# EAGLE design CPU_V1.1 (EAGLE 9.6.2)
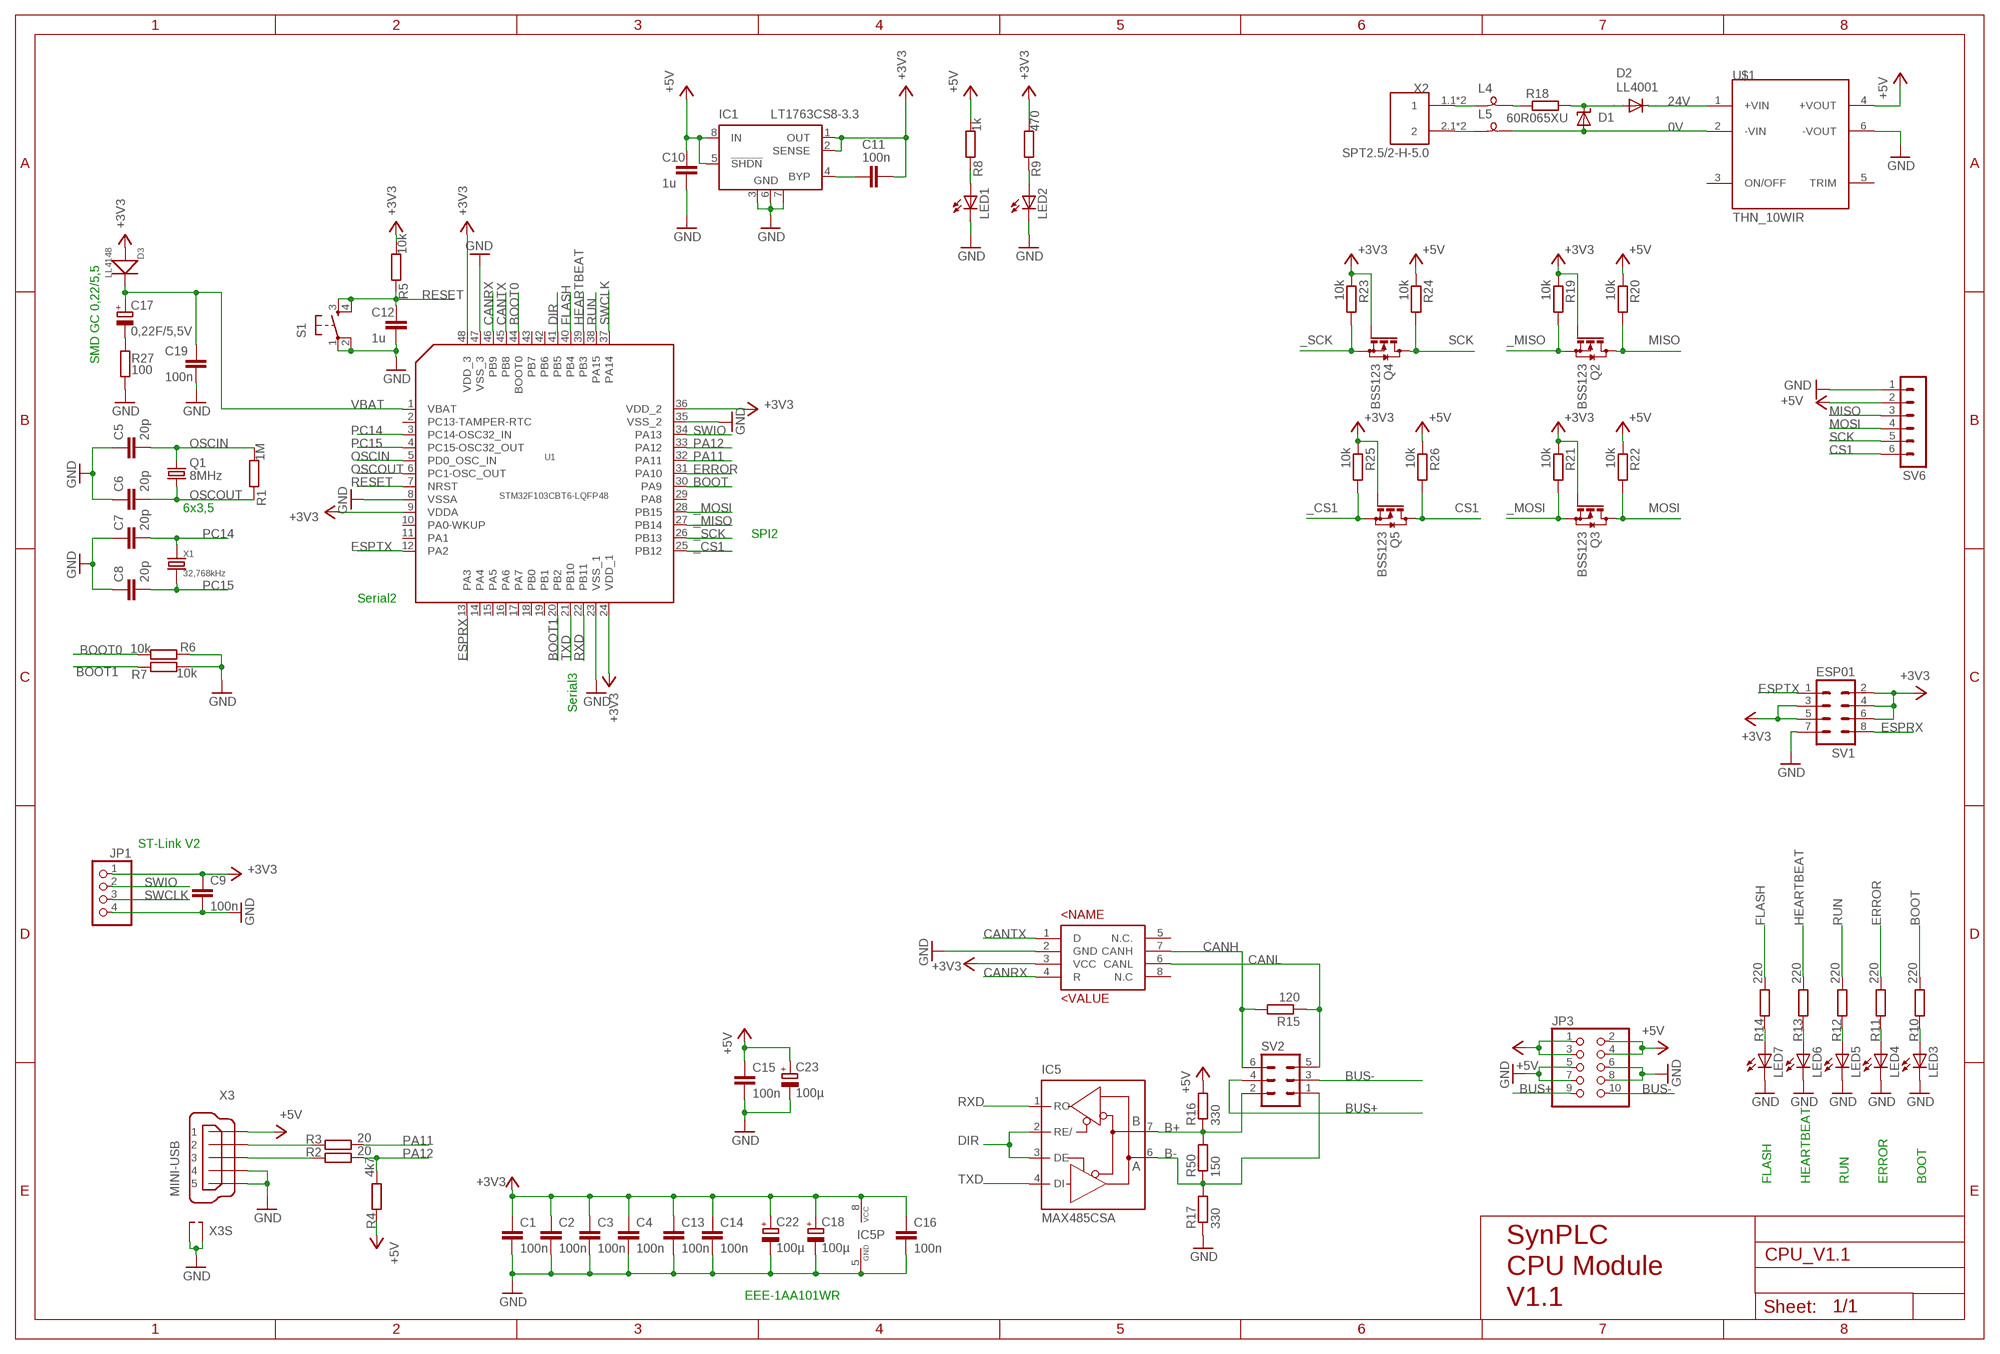
[diagram p0: schematic, sheet 1]

## Parts
C1  100n  C-EUC0805K  [C0805K]
C2  100n  C-EUC0805K  [C0805K]
C3  100n  C-EUC0805K  [C0805K]
C4  100n  C-EUC0805K  [C0805K]
C5  20p  C-EUC0805K  [C0805K]
C6  20p  C-EUC0805K  [C0805K]
C7  20p  C-EUC0805K  [C0805K]
C8  20p  C-EUC0805K  [C0805K]
C9  100n  C-EUC0805K  [C0805K]
C10  1u  C-EUC0805K  [C0805K]
C11  100n  C-EUC0805K  [C0805K]
C12  1u  C-EUC0805K  [C0805K]
C13  100n  C-EUC0805K  [C0805K]
C14  100n  C-EUC0805K  [C0805K]
C15  100n  C-EUC0805  [C0805]
C16  100n  C-EUC0805  [C0805]
C17  0,22F/5,5V  CPOL-EUG  [PANASONIC_G]
C18  100µ  CPOL-EU153CLV-0505  [153CLV-0505]
C19  100n  C-EUC0805K  [C0805K]
C22  100µ  CPOL-EU153CLV-0505  [153CLV-0505]
C23  100µ  CPOL-EU153CLV-0505  [153CLV-0505]
D1  SUPPRESSOR-SMBJ  [SMBJ]
D2  LL4001  CGRM4001-G  [SOD-123_MINI-SMA]
D3  LL4148  DIODE'1N4148-SMD'  [LL-34]
IC1  LT1763CS8-3.3  [SOIC8]
IC5  MAX485CSA  MAX481CSA  [SO08]
JP1  PINHD-1X4/90  [1X04/90]
JP3  PINHD-2X5/90  [2X05/90]
L4  SM-B5  [SM-B5]
L5  SM-B5  [SM-B5]
LED1  LEDSML0805  [SML0805]
LED2  LEDSML0805  [SML0805]
LED3  LED3MM  [LED3MM]
LED4  LED3MM  [LED3MM]
LED5  LED3MM  [LED3MM]
LED6  LED3MM  [LED3MM]
LED7  LED3MM  [LED3MM]
Q1  8MHz  KX-K  [11.4X4.5]
Q2  BSS123  [SOT23]
Q3  BSS123  [SOT23]
Q4  BSS123  [SOT23]
Q5  BSS123  [SOT23]
R1  1M  R-EU_R0805  [R0805]
R2  20  R-EU_R0805  [R0805]
R3  20  R-EU_R0805  [R0805]
R4  4k7  R-EU_R0805  [R0805]
R5  10k  R-EU_R0805  [R0805]
R6  10k  R-EU_R0805  [R0805]
R7  10k  R-EU_R0805  [R0805]
R8  1k  R-EU_R0805  [R0805]
R9  470  R-EU_R0805  [R0805]
R10  220  R-EU_R0805  [R0805]
R11  220  R-EU_R0805  [R0805]
R12  220  R-EU_R0805  [R0805]
R13  220  R-EU_R0805  [R0805]
R14  220  R-EU_R0805  [R0805]
R15  120  R-EU_R0805  [R0805]
R16  330  R-EU_R0805  [R0805]
R17  330  R-EU_R0805  [R0805]
R18  60R065XU  R-EU_0204/5  [0204/5]
R19  10k  R-EU_R0805  [R0805]
R20  10k  R-EU_R0805  [R0805]
R21  10k  R-EU_R0805  [R0805]
R22  10k  R-EU_R0805  [R0805]
R23  10k  R-EU_R0805  [R0805]
R24  10k  R-EU_R0805  [R0805]
R25  10k  R-EU_R0805  [R0805]
R26  10k  R-EU_R0805  [R0805]
R27  100  R-EU_R0805  [R0805]
R50  150  R-EU_R0805  [R0805]
S1  TAC_SWITCHPTH  [TACTILE-PTH]
SV1  ESP01  MA04-2  [MA04-2]
SV2  MA03-2  [MA03-2]
SV6  MA06-1  [MA06-1]
U1  STM32F103CBT6-LQFP48  MCU-STM32F103CBT6(LQFP48)  [LQFP48-0.5-7X7MM]
U$1  THN_10WIR  [THN10WIR]
U$3  SN65HVD232  [SO-08]
X1  32,768kHz  CRYSTAL'9133'  [X2-2.0-D9.1XL3.3MM]
X2  SPT2.5/2-H-5.0  [SPT2]
X3  MINI-USB  MINI-USB_SHIELD5P2-32005-601  [32005-601]

## Nets
0V: D1.A L5.1 U$1.2(-VIN)
24V: D2.C U$1.1(+VIN)
+3V3: C1.1 C2.1 C3.1 C4.1 C9.1 C11.1 C13.1 C14.1 C16.1 C18.+ C22.+ D3.A(+) IC1.1(OUT) IC1.2(SENSE) IC5.8(VCC) JP1.1 Q2.1(G) Q3.1(G) Q4.1(G) Q5.1(G) R5.2 R9.2 R19.1 R21.1 R23.1 R25.1 SV1.2 SV1.3 SV1.4 SV1.5 SV1.6 U1.9(VDDA) U1.24(VDD_1) U1.36(VDD_2) U1.48(VDD_3) U$3.3(VCC)
+5V: C10.1 C15.1 C23.+ IC1.5(!SHDN) IC1.8(IN) JP3.1 JP3.2 JP3.3 JP3.4 R4.1 R8.2 R16.2 R20.1 R22.1 R24.1 R26.1 SV6.2 U$1.4(+VOUT) X3.1
_CS1: Q5.2(S) R25.2 U1.25(PB12)
_MISO: Q2.2(S) R19.2 U1.27(PB14)
_MOSI: Q3.2(S) R21.2 U1.28(PB15)
_SCK: Q4.2(S) R23.2 U1.26(PB13)
B+: IC5.7(B) R16.1 R50.2 SV2.2
B-: IC5.6(A) R17.2 R50.1 SV2.1
BOOT: R10.2 U1.30(PA9)
BOOT0: R6.2 U1.44(BOOT0)
BOOT1: R7.1 U1.20(PB2)
BUS+: JP3.9 SV2.4
BUS-: JP3.10 SV2.3
CANH: R15.2 SV2.6 U$3.7(CANH)
CANL: R15.1 SV2.5 U$3.6(CANL)
CANRX: U1.46(PB9) U$3.4(R)
CANTX: U1.45(PB8) U$3.1(D)
CS1: Q5.3(D) R26.2 SV6.6
DIR: IC5.2(RE/) IC5.3(DE) U1.41(PB5)
ERROR: R11.2 U1.31(PA10)
ESPRX: SV1.8 U1.13(PA3)
ESPTX: SV1.1 U1.12(PA2)
FLASH: R14.2 U1.40(PB4)
GND: C1.2 C2.2 C3.2 C4.2 C5.1 C6.1 C7.1 C8.1 C9.2 C10.2 C12.2 C13.2 C14.2 C15.2 C16.2 C18.- C19.2 C22.- C23.- IC1.3(GND) IC1.6(GND) IC1.7(GND) IC5.5(GND) JP1.4 JP3.5 JP3.6 JP3.7 JP3.8 LED1.C LED2.C LED3.K(C) LED4.K(C) LED5.K(C) LED6.K(C) LED7.K(C) R6.1 R7.2 R17.1 R27.1 S1.1 S1.2 SV1.7 SV6.1 U1.8(VSSA) U1.23(VSS_1) U1.35(VSS_2) U1.47(VSS_3) U$1.6(-VOUT) U$3.2(GND) X3.4 X3.5 X3.M1(S1) X3.M2(S2)
HEARTBEAT: R13.2 U1.39(PB3)
MISO: Q2.3(D) R20.2 SV6.3
MOSI: Q3.3(D) R22.2 SV6.4
N$1: R3.1 X3.2
N$2: R2.1 X3.3
N$3: C11.2 IC1.4(BYP)
N$6: LED2.A R9.1
N$7: LED1.A R8.1
N$8: C17.- R27.2
N$11: LED3.A R10.1
N$12: LED4.A R11.1
N$15: LED5.A R12.1
N$16: LED6.A R13.1
N$17: LED7.A R14.1
N$19: L4.2 X2.1.1 X2.1.2
N$20: L5.2 X2.2.1 X2.2.2
N$21: L4.1 R18.1
N$22: D1.C D2.A R18.2
OSCIN: C5.2 Q1.2 R1.2 U1.5(PD0_OSC_IN)
OSCOUT: C6.2 Q1.1 R1.1 U1.6(PC1-OSC_OUT)
PA11: R3.2 U1.32(PA11)
PA12: R2.2 R4.2 U1.33(PA12)
PC14: C7.2 U1.3(PC14-OSC32_IN) X1.2
PC15: C8.2 U1.4(PC15-OSC32_OUT) X1.1
RESET: C12.1 R5.1 S1.3 S1.4 U1.7(NRST)
RUN: R12.2 U1.38(PA15)
RXD: IC5.1(RO) U1.22(PB11)
SCK: Q4.3(D) R24.2 SV6.5
SWCLK: JP1.3 U1.37(PA14)
SWIO: JP1.2 U1.34(PA13)
TXD: IC5.4(DI) U1.21(PB10)
VBAT: C17.+ C19.1 D3.C(-) U1.1(VBAT)
Unconnected: U1.2(PC13-TAMPER-RTC) U1.10(PA0-WKUP) U1.11(PA1) U1.14(PA4) U1.15(PA5) U1.16(PA6) U1.17(PA7) U1.18(PB0) U1.19(PB1) U1.29(PA8) U1.42(PB6) U1.43(PB7) U$1.3(ON/OFF) U$1.5(TRIM) U$3.5(N.C.) U$3.8(N.C)

## Notes on the sheet
- SMD GC 0,22/5,5
- 6x3,5
- SPI2
- Serial2
- Serial3
- ST-Link V2
- FLASH | HEARTBEAT | RUN | ERROR | BOOT
- EEE-1AA101WR
- SynPLC
  CPU Module
  V1.1

## Library data of the parts
C1-C16 C19 = rcl:C-EU: CAPACITOR, European symbol; SPICEPREFIX: C
C17 C18 C22 C23 = rcl:CPOL-EU: POLARIZED CAPACITOR, European symbol; SPICEPREFIX: C
D1 = diode:SUPPRESSOR-: Suppressor diode
D2 = diode:CGRM400*-G: Molded plasitc,JEDEC SOD-123/Mini SMA Source: Comchip CGRM4001-G.pdf
D3 = Seeed-OPL-Diode:DIODE*
IC1 = linear-technology:LT1763CS8: 500mA, Low Noise, LDO Micropower Regulators Source: http://cds.linear.com/docs/Datasheet/1763ff.pdf; MPN: LT1763CS8-3.3; OC_FARNELL: 1273617; OC_NEWARK: 57M6055
IC5 = maxim:MAX481CSA: RS485 TRANSEIVER; MF: MAXIM; MPN: MAX481CSA; OC_FARNELL: unknown; OC_NEWARK: 90C3817
JP1 = pinhead:PINHD-1X4: PIN HEADER
JP3 = pinhead:PINHD-2X5: PIN HEADER
L4 L5 = inductor-neosid:SM-B: INDUCTOR SMD Bead inductor; OC_FARNELL: unknown; OC_NEWARK: unknown
LED1-LED7 = led:LED: LED OSRAM: - CHIPLED LG R971, LG N971, LY N971, LG Q971, LY Q971, LO R971, LY R971 LH N974, LH R974 LS Q976, LO Q976, LY Q976 LO Q996 - Hyper CHIPLED LW Q18S LB Q993, LB Q99A, LB R99A - SideLED LS A670, LO A670, LY A670, LG A670, LP A670 LB A673, LV A673, LT A673, LW A673 LH A674 LY A675 LS A676, LA A676, LO A676, LY A676, LW A676 LS A679, LY A679, LG A679 - Hyper Micro SIDELED® LS Y876, LA Y876, LO Y876, LY Y876 LT Y87S - SmartLED LW L88C, LW L88S LB L89C, LB L89S, LG L890 LS L89K, LO L89K, LY L89K LS L896, LA L896, LO L896, LY L896 - TOPLED LS T670, LO T670, LY T670, LG T670, LP T670 LSG T670, LSP T670, LSY T670, LOP T670, LYG T670 LG T671, LOG T671, LSG T671 LB T673, LV T673, LT T673, LW T673 LH T674 LS T676, LA T676, LO T676, LY T676, LB T676, LH T676, LSB T676, LW T676 LB T67C, LV T67C, LT T67C, LS T67K, LO T67K, LY T67K, LW E67C LS E67B, LA E67B, LO E67B, LY E67B, LB E67C, LV E67C, LT E67C LW T67C LS T679, LY T679, LG T679 LS T770, LO T770, LY T770, LG T770, LP T770 LB T773, LV T773, LT T773, LW T773 LH T774 LS E675, LA E675, LY E675, LS T675 LS T776, LA T776, LO T776, LY T776, LB T776 LHGB T686 LT T68C, LB T68C - Hyper Mini TOPLED® LB M676 - Mini TOPLED Santana® LG M470 LS M47K, LO M47K, LY M47K Source: http://www.osram.convergy.de LUXEON: - LUMILED® LXK2-PW12-R00, LXK2-PW12-S00, LXK2-PW14-U00, LXK2-PW14-V00 LXK2-PM12-R00, LXK2-PM12-S00, LXK2-PM14-U00 LXK2-PE12-Q00, LXK2-PE12-R00, LXK2-PE12-S00, LXK2-PE14-T00, LXK2-PE14-U00 LXK2-PB12-K00, LXK2-PB12-L00, LXK2-PB12-M00, LXK2-PB14-N00, LXK2-PB14-P00, LXK2-PB14-Q00 LXK2-PR12-L00, LXK2-PR12-M00, LXK2-PR14-Q00, LXK2-PR14-R00 LXK2-PD12-Q00, LXK2-PD12-R00, LXK2-PD12-S00 LXK2-PH12-R00, LXK2-PH12-S00 LXK2-PL12-P00, LXK2-PL12-Q00, LXK2-PL12-R00 Source: www.luxeon.com KINGBRIGHT: KA-3528ASYC Source: www.kingbright.com
Q1 = crystal-geyer_V1_0:KX: Quartz Crystals (MHz) SMD: KX - Serie Model Size l/w/h [mm] Frequency Range Frequency Stability Temp. Range [°C] Load Capacitance AECQ 200 availabel Datasheet KX-4 KX-5 KX-6 KX-7 KX-9A KX-9B KX-12A KX-12B KX-13 KX-20 KX-K KX-KS 1.6/1.2/0.3 2.0/1.6/0.45 2.5/2.0/0.55 3.2/2.5/0.8 5.0/3.2/1.0 5.0/3.2/1.1 6.0/3.5/1.1 6.0/3.5/1.0 7.0/5.0 /1.3 11.6/5.5/1.6 12.3/4.5/4.2 12.3/4.5/3.2 24.0 ~ 80.0 MHz 16.0 ~ 80.0 MHz 12.0 ~ 80.0 MHz 8.0 ~ 60.0 MHz 7,68 ~ 300,0 MHz 8,0 ~ 50,0 MHz 8,0 ~ 150,0 MHz 8,0 ~ 50,0 MHz 6,0 ~ 160,0 MHz 3,579 ~ 25,0 MHz 3,579 ~ 70,0 MHz 3,579 ~ 70,0 MHz ±10 … ±50ppm ±10 … ±50ppm ±10 … ±50ppm ±10 … ±50ppm ±10 … ±50ppm ±10 … ±50ppm ±10 … ±50ppm ±10 … ±50ppm ±10 … ±50ppm ±50ppm ±10 … ±50ppm ±10 … ±50ppm (*) -40°C …+85°C (*) -40°C …+125°C (*) -40°C …+125°C (*) -40°C …+125°C (*) -40°C …+105°C (*) -40°C …+105°C (*) -40°C …+125°C (*) -40°C …+105°C (*) -40°C …+105°C (*) -40°C …+105°C (*) -40°C …+85°C (*) -40°C …+85°C 8, 8…16 8, 8…16 10, 8…16 12, 7…20 16, 10…20 16, 10…20 16, 10…20 16, 12…20 16, 12…20 16, 12…20 16, 12…30 16, 12…30 - yes yes yes - - - - - - - - KX-4.pdf <http://www.geyer-electronic.de/uploads/tx_userartikelfrequenz/GEYER-KX-4.pdf> KX-5.pdf <http://www.geyer-electronic.de/uploads/tx_userartikelfrequenz/GEYER-KX-5.pdf> KX-6.pdf <http://www.geyer-electronic.de/uploads/tx_userartikelfrequenz/GEYER-KX-6.pdf> KX-7.pdf <http://www.geyer-electronic.de/uploads/tx_userartikelfrequenz/GEYER-KX-7.pdf> KX-9A.pdf <http://www.geyer-electronic.de/uploads/tx_userartikelfrequenz/GEYER-KX-9A.pdf> KX-9B.pdf <http://www.geyer-electronic.de/uploads/tx_userartikelfrequenz/GEYER-KX-9B.pdf> KX-12A.pdf <http://www.geyer-electronic.de/uploads/tx_userartikelfrequenz/GEYER-KX-12A.pdf> KX-12B.pdf <http://www.geyer-electronic.de/uploads/tx_userartikelfrequenz/GEYER-KX-12B.pdf> KX-13.pdf <http://www.geyer-electronic.de/uploads/tx_userartikelfrequenz/GEYER-KX-13.pdf> KX-20.pdf <http://www.geyer-electronic.de/uploads/tx_userartikelfrequenz/GEYER-KX-20.pdf> KX-K.pdf <http://www.geyer-electronic.de/uploads/tx_userartikelfrequenz/GEYER-KX-K.pdf> KX-KS.pdf <http://www.geyer-electronic.de/uploads/tx_userartikelfrequenz/GEYER-KX-KS.pdf> <http://www.geyer-electronic.de/fileadmin/template/img/logo-geyer-electronic.png> Details see: http://www.geyer-electronic.de/Frequenz-Produkte.9.0.html Created 2016-06-07, Hans Locher 2016 (C) Geyer Quartz Technology KX4,KX5,KX6,KX7,KX9A,KX9B,KX12A,KX12B,KX13,KX20,KXK,KXKS;1612;2016;2520;3225;5032;6035;7050;11655;12345;1,6x1,2;2,0x1,6;2,5x2,0;3,2x2,5;5,0x3,2;6,0x3,5;7,0x5,0;11,6x5,5;12,3x4,5;12,3x4,5;1.6x1.2;2.0x1.6;2.5x2.0;3.2x2.5;5.0x3.2;6.0x3.5;7.0x5.0;11.6x5.5;12.3x4.5;12.3x4.5;
Q2-Q5 = transistor-small-signal:BSS123: N-CHANNEL MOS FET
R1-R27 R50 = rcl:R-EU_: RESISTOR, European symbol; SPICEPREFIX: R
S1 = SparkFun-Retired:TAC_SWITCH: Momentary Switch Button commonly used for reset or general input. Spark Fun Electronics SKU : COM-00097 SMT- SWCH-08247
SV1 = con-lstb:MA04-2: PIN HEADER; OC_FARNELL: unknown; OC_NEWARK: unknown
SV2 = con-lstb:MA03-2: PIN HEADER; OC_FARNELL: unknown; OC_NEWARK: unknown
SV6 = con-lstb:MA06-1: PIN HEADER; OC_FARNELL: unknown; OC_NEWARK: unknown
U1 = Seeed-OPL-ic:MCU-STM32F103CBT6(LQFP48): 310010004; MPN: STM32F103CBT6
U$1 = traco-electronic:THN_10WIR
U$3 = texas:SN65HVD232
X1 = Seeed-OPL-Crystal-Oscillator:CRYSTAL
X2 = con-phoenix-500:SPT2.5/2-H-5.0: Phönix Contact SPT 2.5/ 2-H-5.0 Federzugklemme 2polig 5mm liegend 1990973
X3 = con-cypressindustries:MINI-USB_SHIELD5P2-: MINI USB-B R/A DIP 5pol. Source: www.cypressindustries.com; OC_FARNELL: unknown; OC_NEWARK: unknown

## Board
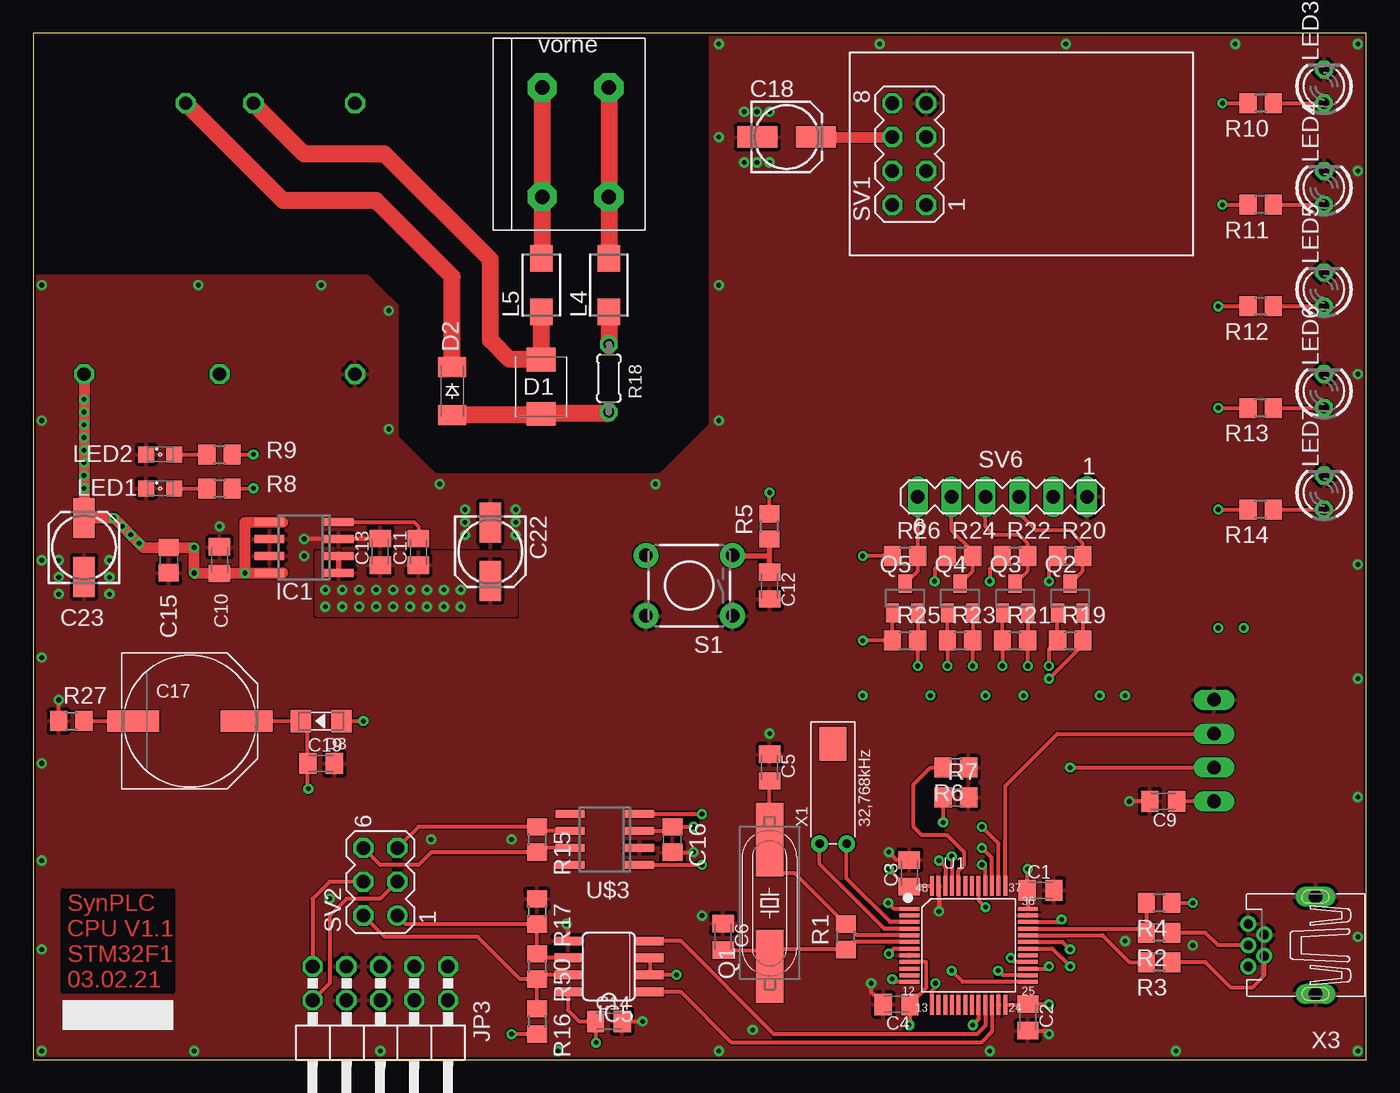
[diagram p1: board, top side]
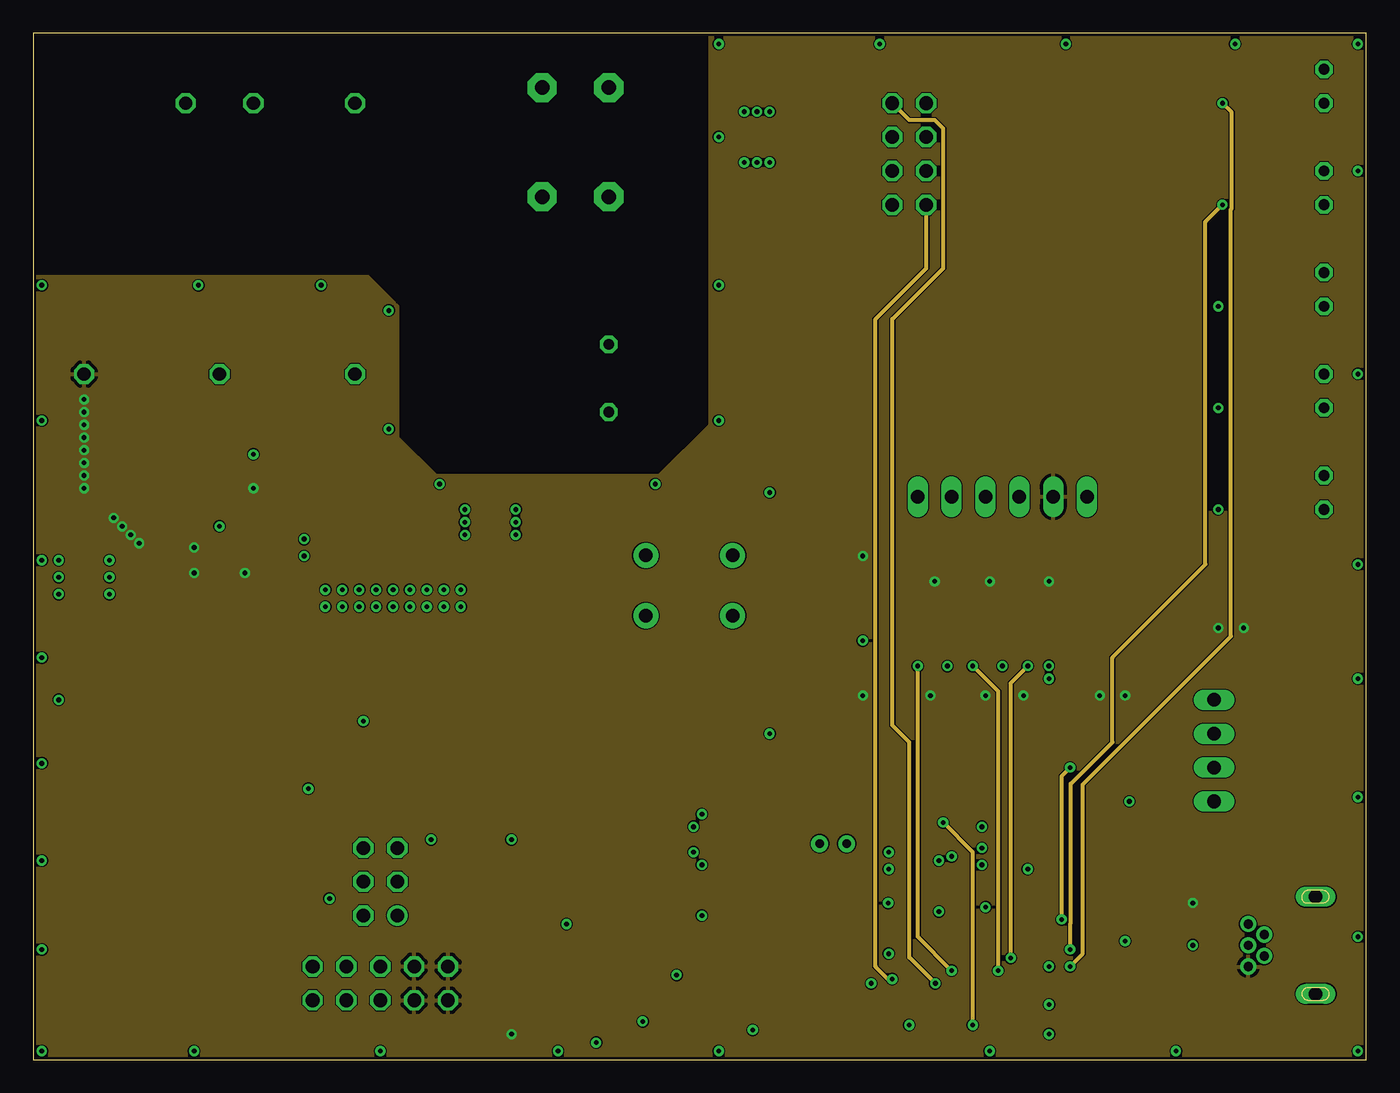
[diagram p2: board, inner layer Route2]
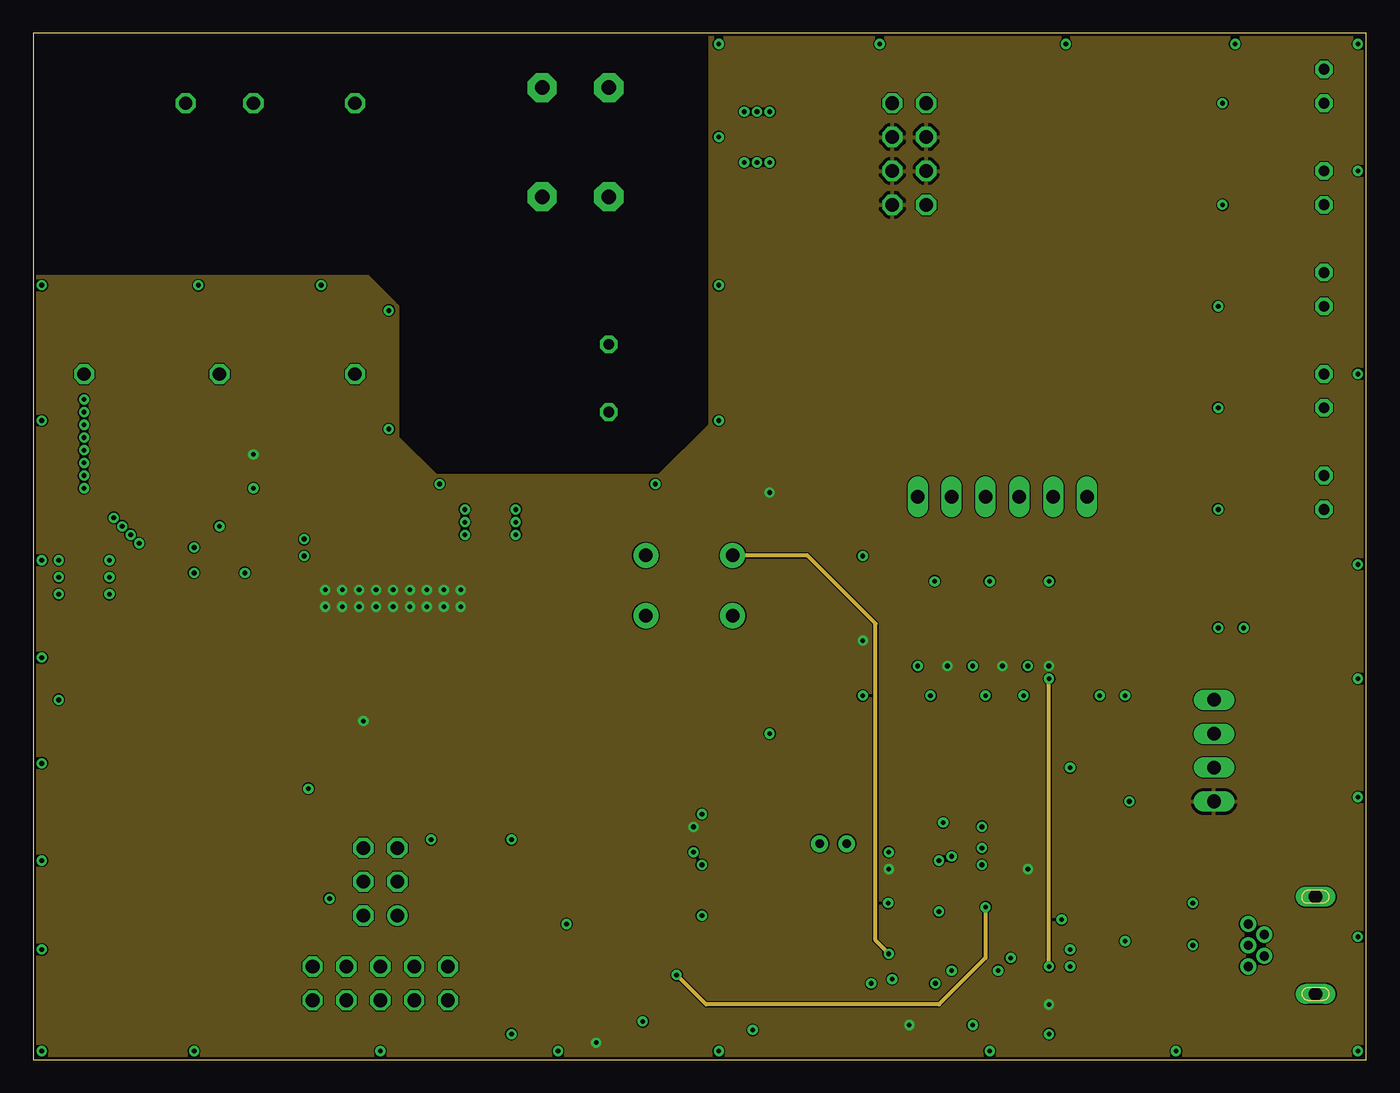
[diagram p3: board, inner layer Route15]
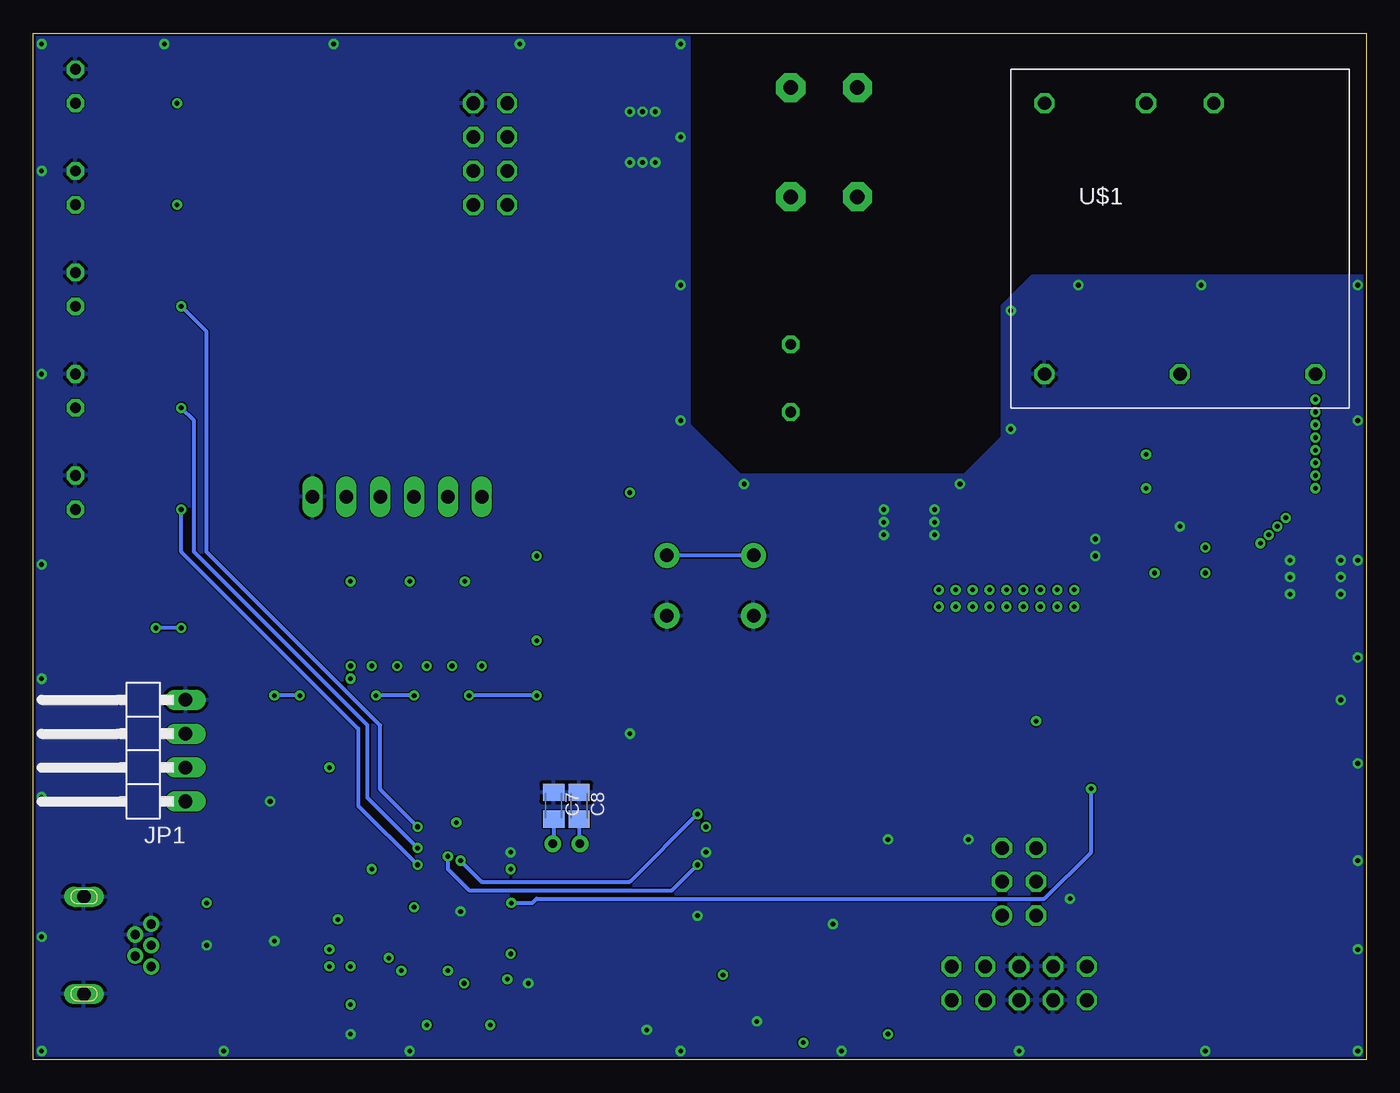
[diagram p4: board, bottom side, seen from below]

Size 100 x 77 mm. Coordinates in mm from the lower left corner, seen from the top.
Outline: 0,0 100,0 100,77 0,77 0,0
Copper layers (1+2*15+16): Top 0.035mm / dielectric 0.2mm / Route2 0.017mm / dielectric 1.065mm / Route15 0.017mm / dielectric 0.2mm / Bottom 0.035mm
Design rules "jlc *": minimum track width 3.5mil, minimum drill 0.2mm, track to track 3.5mil, track to pad 6mil, pad to pad 6mil, via to via 6mil, smd to smd 6mil, copper to edge 0.2mm, drill to drill 6mil, minimum pad ring 10mil, minimum via ring 8mil, stop-mask expansion 4mil, vias tented up to drill 0mil, thermal gap 10mil
tRestrict: 11 lines

### Footprints (pad centres in the part's own frame; a part is rotated, then mirrored left to right if it is on the bottom)
C0805K = smd 1.3 x 1.6: 1 -1,0; 2 1,0
C0805 = smd 1.3 x 1.5: 1 -0.95,0; 2 0.95,0
PANASONIC_G = smd 3.9 x 1.6: + 4.25,0; - -4.25,0
153CLV-0505 = smd 3 x 1.6: + 2.2,0; - -2.2,0
SMBJ = smd 1.78 x 2.16: A 2.04,0; C -2.03,0
SOD-123_MINI-SMA = smd 1.5 x 2.1: A 1.8,0; C -1.8,0
LL-34 = smd 1.524 x 1.676: A -1.524,0; C 1.524,0
SOIC8 = smd 0.6 x 2.2: 1 -1.905,-2.6; 2 -0.635,-2.6; 3 0.635,-2.6; 4 1.905,-2.6; 5 1.905,2.6; 6 0.635,2.6; 7 -0.635,2.6; 8 -1.905,2.6
SO08 = smd 0.66 x 2.032: 1 -1.905,-3.073; 2 -0.635,-3.073; 3 0.635,-3.073; 4 1.905,-3.073; 5 1.905,3.073; 6 0.635,3.073; 7 -0.635,3.073; 8 -1.905,3.073
1X04/90 = drill 1.016 long: 1 -3.81,-3.81; 2 -1.27,-3.81; 3 1.27,-3.81; 4 3.81,-3.81
2X05/90 = drill 1.016 octagon: 1 -5.08,-6.35; 2 -5.08,-3.81; 3 -2.54,-6.35; 4 -2.54,-3.81; 5 0,-6.35; 6 0,-3.81; 7 2.54,-6.35; 8 2.54,-3.81; 9 5.08,-6.35; 10 5.08,-3.81
SM-B5 = smd 2 x 1.7: 1 -2,0; 2 2,0
SML0805 = smd 1.2 x 1.2: A 1.05,0; C -1.05,0
LED3MM = drill 0.813 octagon: A -1.27,0; K 1.27,0
11.4X4.5 = smd 5.5 x 2.08: 1 -4.75,0; 2 4.75,0
SOT23 = smd 1 x 1.4: 1 -0.95,-1.1; 2 0.95,-1.1; 3 0,1.1
R0805 = smd 1.3 x 1.5: 1 -0.95,0; 2 0.95,0
0204/5 = drill 0.813 octagon: 1 -2.54,0; 2 2.54,0
TACTILE-PTH = drill 1.016 pad 1.88: 1 -3.251,2.261; 2 3.251,2.261; 3 -3.251,-2.261; 4 3.251,-2.261
MA04-2 = drill 1.016 octagon: 1 -3.81,-1.27; 2 -3.81,1.27; 3 -1.27,-1.27; 4 -1.27,1.27; 5 1.27,-1.27; 6 1.27,1.27; 7 3.81,-1.27; 8 3.81,1.27
MA03-2 = drill 1.016: 1 -2.54,-1.27 | drill 1.016 octagon: 2 -2.54,1.27; 3 0,-1.27; 4 0,1.27; 5 2.54,-1.27; 6 2.54,1.27
MA06-1 = drill 1.016 long: 1 -6.35,0; 2 -3.81,0; 3 -1.27,0; 4 1.27,0; 5 3.81,0; 6 6.35,0
LQFP48-0.5-7X7MM = smd 1.5 x 0.3: 1 -4.45,2.75; 2 -4.45,2.25; 3 -4.45,1.75; 4 -4.45,1.25; 5 -4.45,0.75; 6 -4.45,0.25; 7 -4.45,-0.25; 8 -4.45,-0.75; 9 -4.45,-1.25; 10 -4.45,-1.75; 11 -4.45,-2.25; 12 -4.45,-2.75; 25 4.45,-2.75; 26 4.45,-2.25; 27 4.45,-1.75; 28 4.45,-1.25; 29 4.45,-0.75; 30 4.45,-0.25; 31 4.45,0.25; 32 4.45,0.75; 33 4.45,1.25; 34 4.45,1.75; 35 4.45,2.25; 36 4.45,2.75 | smd 0.3 x 1.5: 13 -2.75,-4.45; 14 -2.25,-4.45; 15 -1.75,-4.45; 16 -1.25,-4.45; 17 -0.75,-4.45; 18 -0.25,-4.45; 19 0.25,-4.45; 20 0.75,-4.45; 21 1.25,-4.45; 22 1.75,-4.45; 23 2.25,-4.45; 24 2.75,-4.45; 37 2.75,4.45; 38 2.25,4.45; 39 1.75,4.45; 40 1.25,4.45; 41 0.75,4.45; 42 0.25,4.45; 43 -0.25,4.45; 44 -0.75,4.45; 45 -1.25,4.45; 46 -1.75,4.45; 47 -2.25,4.45; 48 -2.75,4.45
THN10WIR = drill 1 octagon: 1 15.24,22.86; 2 10.16,22.86; 3 2.54,22.86; 4 22.86,2.54; 5 12.7,2.54; 6 2.54,2.54
SO-08 = smd 0.6 x 2.2: 1 -1.905,-2.6; 2 -0.635,-2.6; 3 0.635,-2.6; 4 1.905,-2.6; 5 1.905,2.6; 6 0.635,2.6; 7 -0.635,2.6; 8 -1.905,2.6
X2-2.0-D9.1XL3.3MM = drill 0.635 pad 1.27: 1 -1.016,0; 2 1.016,0 | smd 2.032 x 2.54: 3 0,7.493
SPT2 = drill 1.1 pad 2.184 octagon: 1.1 7.3,10.7; 1.2 7.3,2.5; 2.1 2.3,10.7; 2.2 2.3,2.5
32005-601 = drill 0.7 pad 1.016: 1 2.825,1.6; 2 1.625,0.8; 3 2.825,0; 4 1.625,-0.8; 5 2.825,-1.6 | drill 1 pad 1.422 long: M1 -2.225,3.65; M2 -2.225,-3.65

### Placement (x,y rotation side)
C1  75.56,12.7 0 top
C2  74.61,3.17 270 top
C3  65.72,13.97 90 top
C4  64.77,4.13 180 top
C5  55.24,21.91 270 top
C6  51.75,9.21 270 top
C7  60.96,19.05 270 bottom
C8  59.05,19.05 270 bottom
C9  84.77,19.37 180 top
C10  13.97,37.47 90 top
C11  28.89,38.1 90 top
C12  55.24,35.56 270 top
C13  26.04,38.1 90 top
C14  43.18,2.86 0 top
C15  10.16,37.47 270 top
C16  47.94,16.51 270 top
C17  11.75,25.4 0 top
C18  56.52,69.22 0 top
C19  21.59,22.23 0 top
C22  34.29,38.1 270 top
C23  3.81,38.42 90 top
D1  38.1,50.48 90 top
D2  31.43,50.16 270 top
D3  21.59,25.4 180 top
IC1  20.32,38.42 90 top
IC5  43.18,6.99 90 top
JP1  92.39,23.18 90 bottom
JP3  26.04,0.64 180 top
L4  43.18,58.1 90 top
L5  38.1,58.1 90 top
LED1  9.53,42.86 0 top
LED2  9.53,45.4 0 top
LED3  96.84,73.03 90 top
LED4  96.84,65.41 90 top
LED5  96.84,57.78 90 top
LED6  96.84,50.16 90 top
LED7  96.84,42.55 90 top
Q1  55.24,11.75 90 top
Q2  77.79,34.61 0 top
Q3  73.66,34.61 0 top
Q4  69.53,34.61 0 top
Q5  65.41,34.61 0 top
R1  60.96,9.21 90 top
R2  84.45,9.53 180 top
R3  84.45,7.3 180 top
R4  84.45,11.75 180 top
R5  55.24,40.01 90 top
R6  69.22,21.91 180 top
R7  69.22,19.68 0 top
R8  13.97,42.86 0 top
R9  13.97,45.4 0 top
R10  92.08,71.75 180 top
R11  92.08,64.14 180 top
R12  92.08,56.52 180 top
R13  92.08,48.9 180 top
R14  92.08,41.27 180 top
R15  37.78,16.51 270 top
R16  37.78,2.86 270 top
R17  37.78,11.11 270 top
R18  43.18,51.12 270 top
R19  77.79,31.43 0 top
R20  77.79,37.78 0 top
R21  73.66,31.43 0 top
R22  73.66,37.78 0 top
R23  69.53,31.43 0 top
R24  69.53,37.78 0 top
R25  65.41,31.43 0 top
R26  65.41,37.78 0 top
R27  2.86,25.4 0 top
R50  37.78,6.99 270 top
S1  49.21,35.56 180 top
SV1  65.72,67.94 90 top
SV2  26.04,13.34 90 top
SV6  72.71,42.23 180 top
U1  70.17,8.57 0 top
U$1  26.67,48.9 0 bottom
U$3  42.86,16.51 90 top
X1  60.01,16.19 0 top
X2  35.88,62.23 0 top
X3  93.98,8.57 180 top

### Tracks (layer width: path | path; a pad name or v marks a point on that pad's centre or on a via)
0V
  Top 1.27: L5.1 D1.A 35.74,52.52 34.29,53.98 34.29,60.01 26.35,67.94 20.32,67.94 U$1.2
24V
  Top 1.27: D2.C 31.43,58.74 25.72,64.45 18.73,64.45 U$1.1
+3V3  (via drill 0.35)
  Top 0.305: U$3.3 47.63,17.14 C16.1 v49.53,17.46 | U1.48 65.78,13.02 C3.1 65.5,12.97 v64.18,14.29 | JP1.1 C9.1 | U1.24 74.56,4.12 C2.1 76.15,4.17 v76.2,4.13 | U1.9 66.97,7.32 66.99,7.3 66.99,5.4 65.77,4.17 C4.1 65.77,2.63 v65.72,2.59 | U1.36 74.62,12.65 C1.1 74.56,14.24 v74.61,14.29 | R5.2 v55.24,42.55 | R9.2 v16.51,45.4 | D3.A v24.77,25.4 | IC5.8 40.11,3.71 40.96,2.86 C14.1 42.18,1.32 v42.23,1.27 | v62.23,31.43 R25.1 Q5.1 | v68.58,29.53 R23.1 Q4.1 | v72.71,29.53 R21.1 Q3.1 | v76.19,29.53 76.19,30.79 R19.1 Q2.1
  Top 0.406: IC1.1 22.92,37.15 IC1.2
  Top 0.813: C18.+ SV1.6
  other vias: 32.07,35.24 30.8,35.24 29.53,35.24 28.26,35.24 26.99,35.24 25.72,35.24 24.45,35.24 23.18,35.24 21.91,35.24 21.91,33.97 23.18,33.97 24.45,33.97 25.72,33.97 26.99,33.97 28.26,33.97 29.53,33.97 30.8,33.97 32.07,33.97
  pour Route15 (rank 6): 0,58.74 25.08,58.74 27.3,56.52 27.3,46.67 30.16,43.81 46.99,43.81 50.8,47.62 50.8,76.83 100.01,76.83 100.01,0 0,0
  pour Top: 21.59,38.1 36.2,38.1 36.2,33.34 21.27,33.34 21.27,38.1
+5V  (via drill 0.35)
  Top 0.305: R8.2 v16.51,42.86 | R20.1 76.2,37.15 v76.2,35.88 | R22.1 71.75,36.83 v71.75,35.88 | R24.1 67.63,36.83 v67.63,35.88 | R26.1 v62.23,37.78 | R4.1 v87,11.75 | R16.2 v35.88,1.91
  Top 0.813: U$1.4 v3.81,49.53 v3.81,48.58 v3.81,47.62 v3.81,46.67 v3.81,45.72 v3.81,44.77 v3.81,43.81 v3.81,42.86 C23.+ 6.05,40.62 v7.94,38.73 8.26,38.41 C15.1 v12.06,38.41 | v12.06,38.41 v12.06,38.42 | v12.06,38.41 v12.06,36.52 v12.06,36.51 12.11,36.47 C10.1 14.02,36.51 v15.88,36.51 | v15.88,36.51 IC1.8 18.73,36.51 | v15.88,36.51 15.88,40.32 IC1.5 18.73,40.32
  Bottom 0.305: v62.23,27.3 v67.31,27.3 | v71.44,27.3 v74.3,27.3 | v80.01,27.3 v81.92,27.3 | v88.9,32.38 v90.81,32.38
  other vias: 7.3,39.37 6.67,40.01 6.03,40.64
  pour Route2 (rank 6): 0,58.74 25.08,58.74 27.3,56.52 27.3,46.67 30.16,43.81 46.99,43.81 50.8,47.62 50.8,76.83 100.01,76.83 100.01,0 0,0
_CS1  (via drill 0.35)
  Top 0.305: U1.25 69.74,5.82 v68.9,6.67 | v66.36,29.53 R25.2 Q5.2
  Route2 0.305: v68.9,6.67 66.36,9.21 v66.36,29.53
_MISO  (via drill 0.35)
  Top 0.305: Q2.2 R19.2 78.74,31.11 v76.2,28.57 | U1.27 76.04,6.82 v76.2,6.99
  Route15 0.305: v76.2,6.99 v76.2,28.57
_MOSI  (via drill 0.35)
  Top 0.305: Q3.2 R21.2 v74.61,29.53 | U1.28 73.63,7.32 v73.34,7.62
  Route2 0.305: v73.34,7.62 73.34,28.25 v74.61,29.53
_SCK  (via drill 0.35)
  Top 0.305: Q4.2 R23.2 v70.48,29.53 | U1.26 72.73,6.32 v72.39,6.67
  Route2 0.305: v70.48,29.53 72.39,27.62 v72.39,6.67
B+
  Top 0.305: IC5.7 38.1,6.35 R50.2 | R16.1 R50.2 | R50.2 36.51,6.04 33.34,9.21 26.35,9.21 SV2.2
B-
  Top 0.305: IC5.6 38.1,7.62 R50.1 R17.2 27.94,10.16 SV2.1
BOOT  (via drill 0.35)
  Top 0.305: U1.30 76.45,8.32 v77.79,6.99 | v89.22,71.75 R10.2
  Route2 0.305: v77.79,6.99 78.74,7.94 78.74,20.64 89.85,31.75 89.85,63.8 89.9,63.85 89.9,71.07 v89.22,71.75
BOOT0
  Top 0.305: U1.44 69.42,14.17 69.85,14.61 69.85,15.56 68.58,16.83 66.67,16.83 66.04,17.46 66.04,20.64 67.31,21.91 R6.2
BOOT1  (via drill 0.35)
  Top 0.305: U1.20 70.92,3.02 v70.48,2.59 | v68.26,17.78 R7.1
  Route2 0.305: v70.48,2.59 70.48,15.56 v68.26,17.78
BUS+
  Top 0.305: SV2.4 22.23,13.34 20.95,12.06 JP3.9
BUS-
  Top 0.305: SV2.3 26.04,12.06 23.5,12.06 22.23,10.79 22.23,5.71 JP3.10
CANH
  Top 0.305: U$3.7 38.1,15.88 R15.2 29.85,15.56 28.89,14.61 26.04,14.61 SV2.6
CANL
  Top 0.305: U$3.6 38.1,17.14 R15.1 28.89,17.46 SV2.5
CANRX  (via drill 0.35)
  Top 0.305: U$3.4 v50.16,18.41 | v67.94,14.92 68.42,14.45 U1.46
  Bottom 0.305: v67.94,14.92 66.36,13.34 55.24,13.34 v50.16,18.41
CANTX  (via drill 0.35)
  Top 0.305: U$3.1 v50.16,14.61 | v68.9,15.24 68.92,15.22 U1.45
  Bottom 0.305: v50.16,14.61 52.07,12.7 67.31,12.7 68.9,14.29 v68.9,15.24
CS1
  Top 0.305: Q5.3 66.36,36.66 R26.2 SV6.6
DIR  (via drill 0.35)
  Top 0.305: IC5.3 IC5.2 v48.26,6.35 | U1.41 70.92,11.95 v71.44,11.43
  Route15 0.305: v71.44,11.43 71.44,7.62 67.94,4.13 50.48,4.13 v48.26,6.35
ERROR  (via drill 0.35)
  Top 0.305: U1.31 77.22,8.82 v77.79,8.26 | v89.22,64.14 R11.2
  Route2 0.305: v77.79,8.26 77.79,10.18 77.83,10.22 77.83,20.69 80.96,23.81 80.96,30.16 87.95,37.15 87.95,62.87 v89.22,64.14
ESPRX  (via drill 0.35)
  Top 0.305: U1.13 67.42,5.14 67.67,5.4 v67.67,5.71
  Route2 0.305: v67.67,5.71 65.72,7.67 65.72,23.81 64.45,25.08 64.45,55.56 68.26,59.37 68.26,69.85 67.63,70.48 65.72,70.48 SV1.8
ESPTX  (via drill 0.35)
  Top 0.305: U1.12 64.65,5.82 v64.44,6.03
  Route2 0.305: v64.44,6.03 64.12,6.03 63.18,6.97 63.18,55.56 66.99,59.37 SV1.1
FLASH  (via drill 0.35)
  Top 0.305: U1.40 71.42,14.36 v71.17,14.61 | v88.9,41.27 R14.2
  Bottom 0.305: v71.17,14.61 75.61,19.05 75.61,24.81 88.9,38.1 v88.9,41.27
GND  (via drill 0.35)
  Top 0.305: IC5.5 40.11,10.06 v40.01,10.16 | C16.2 v49.53,15.56 | C14.2 v45.72,2.86 | R27.1 v1.91,26.99 | C13.2 25.99,39.05 IC1.3 v20.32,39.05 | C9.2 v82.23,19.37 | C2.2 75.93,2.17 v76.2,1.91 | C4.2 62.87,5.03 v62.87,5.71 | C3.2 64.77,14.97 v64.18,15.56 | U1.47 67.94,12.99 v67.94,11.11
  other vias: 5.71,37.47 5.71,36.2 5.71,34.92 1.91,34.92 1.91,36.2 1.91,37.47 32.38,39.37 32.38,40.32 32.38,41.27 36.2,41.27 36.2,40.32 36.2,39.37 53.34,71.12 54.29,71.12 55.24,71.12 55.24,67.31 54.29,67.31 53.34,67.31 35.88,16.51 29.84,16.51 22.23,12.06 81.92,8.89 87,8.57 53.98,2.22 99.38,0.64 85.72,0.64 71.75,0.64 51.44,0.64 39.37,0.64 26.04,0.64 12.06,0.64 0.64,0.64 0.64,8.26 0.64,14.92 0.64,22.23 0.64,30.16 0.64,37.47 0.64,47.94 0.64,58.1 21.59,58.1 26.67,56.2 12.38,58.1 26.67,47.31 30.48,43.18 46.67,43.18 51.44,47.94 51.44,58.1 51.44,69.22 51.44,76.2 63.5,76.2 77.47,76.2 90.17,76.2 99.38,76.2 99.38,66.67 99.38,51.44 99.38,37.15 99.38,28.57 99.38,19.68 99.38,9.21 20.32,37.78 13.97,40.01 50.16,10.79 55.24,24.45
  pour Top (rank 6): 0,0 100.01,0 100.01,76.83 50.8,76.83 50.8,47.62 46.99,43.81 30.16,43.81 27.3,46.67 27.3,56.52 26.04,57.78 25.08,58.74 0,58.74
  pour Bottom: 0,58.74 25.08,58.74 27.3,56.52 27.3,46.67 30.16,43.81 46.99,43.81 50.8,47.62 50.8,76.83 100.01,76.83 100.01,0 0,0
HEARTBEAT  (via drill 0.35)
  Top 0.305: U1.39 71.92,15.13 v71.17,15.88 | v88.9,48.9 R13.2
  Bottom 0.305: v71.17,15.88 74.93,19.64 74.93,25.08 87.95,38.1 87.95,47.94 v88.9,48.9
MISO
  Top 0.305: Q2.3 78.74,36.66 R20.2 78.74,38.74 77.79,39.69 75.25,39.69 73.98,40.96 SV6.3
MOSI
  Top 0.305: Q3.3 74.61,36.66 R22.2 74.61,38.74 73.98,39.37 72.07,39.37 71.44,40.01 SV6.4
N$1
  Top 0.305: X3.2 92.36,6.31 91.44,5.4 89.85,5.4 87.95,7.3 R3.1
N$2
  Top 0.305: X3.3 88.9,8.57 87.95,9.53 R2.1
N$3
  Top 0.305: IC1.4 28.57,40.32 28.89,40.01 C11.2
N$6
  Top 0.305: LED2.A R9.1
N$7
  Top 0.305: LED1.A R8.1
N$8
  Top 0.305: R27.2 C17.-
N$11
  Top 0.305: R10.1 LED3.A
N$12
  Top 0.305: R11.1 LED4.A
N$15
  Top 0.305: R12.1 LED5.A
N$16
  Top 0.305: R13.1 LED6.A
N$17
  Top 0.305: R14.1 LED7.A
N$19
  Top 1.27: L4.2 X2.1.2 X2.1.1
N$20
  Top 1.27: L5.2 38.18,60.18 X2.2.2 X2.2.1
N$21
  Top 1.27: L4.1 R18.1
N$22
  Top 1.27: R18.2 43.05,48.45 D1.C 38.01,48.37 D2.A
OSCIN
  Top 0.305: U1.5 61.8,9.32 R1.2 57.15,13.97 55.56,13.97 55.24,14.29 Q1.2 C5.2
OSCOUT
  Top 0.305: U1.6 61.52,8.82 R1.1 55.87,8.26 55.4,7.79 | 55.4,7.79 55.24,7.63 Q1.1 | C6.2 54.98,8.21 55.4,7.79
PA11
  Top 0.305: U1.32 80.21,9.32 82.23,7.3 R3.2
PA12
  Top 0.305: U1.33 83.21,9.82 83.34,9.69 | 83.34,9.69 R2.2 | R4.2 83.5,9.85 83.34,9.69
PC14
  Top 0.305: U1.3 64.29,10.32 61.02,13.59 X1.2
  Bottom 0.305: C7.2 60.96,16.26 X1.2
PC15
  Top 0.305: U1.4 63.84,9.82 58.99,14.67 X1.1
  Bottom 0.305: C8.2 59.05,16.26 X1.1
RESET  (via drill 0.35)
  Top 0.305: U1.7 64.57,8.32 v64.18,7.94
  Top 0.406: R5.1 55.24,37.78 | 55.24,37.78 C12.1 | S1.3 52.5,37.78 55.24,37.78
  Route15 0.305: v64.18,7.94 63.18,8.94 63.18,32.7 58.06,37.82 S1.3
  Bottom 0.305: S1.4 S1.3
RUN  (via drill 0.35)
  Top 0.305: U1.38 72.42,16.21 v71.17,17.46 | v88.9,56.52 R12.2
  Bottom 0.305: v71.17,17.46 73.98,20.27 73.98,25.08 87,38.1 87,54.61 v88.9,56.52
RXD
  Top 0.305: U1.22 71.92,2.07 71.12,1.27 52.39,1.27 48.58,5.08 IC5.1
SCK
  Top 0.305: Q4.3 70.48,36.66 R24.2 70.48,38.1 68.9,39.69 SV6.5
SWCLK
  Top 0.305: U1.37 72.92,20.53 76.83,24.45 JP1.3
SWIO  (via drill 0.35)
  Top 0.305: U1.34 76.97,10.32 v77.15,10.51 | v77.79,21.91 JP1.2
  Route2 0.305: v77.15,10.51 77.15,21.27 v77.79,21.91
TXD
  Top 0.305: U1.21 71.42,2.52 70.8,1.91 55.56,1.91 48.58,8.89 IC5.4
VBAT  (via drill 0.35)
  Top 0.305: U1.1 64.56,11.32 v64.14,11.75 | v20.64,20.32 20.59,20.37 C19.1 20.59,24.88 D3.C C17.+
  Bottom 0.305: v64.14,11.75 62.55,11.75 62.23,12.06 24.13,12.06 20.64,15.56 v20.64,20.32

### Text on the board
Top: SynPLC / CPU V1.1 / STM32F1 / 03.02.21
tValues: JLCJLCJLCJLC | GND / SWCLK / SWIO / 3V3